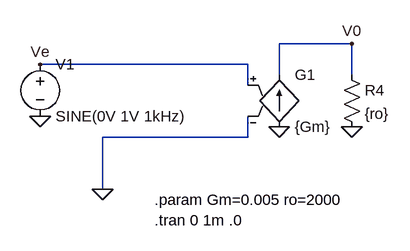
[diagram p0: schematic tut1ques3a.asc]
tut1ques3a.asc, the LTspice schematic file:
Version 4
SHEET 1 880 680
WIRE 96 -128 -16 -128
WIRE -64 -96 -384 -96
WIRE -16 -80 -16 -128
WIRE 96 -80 96 -128
WIRE -64 -64 -64 -96
WIRE -64 16 -64 -16
WIRE -64 16 -288 16
WIRE -288 96 -288 16
FLAG -16 0 0
FLAG 96 0 0
FLAG -384 -16 0
FLAG -288 96 0
FLAG -384 -96 Ve
FLAG 96 -128 V0
SYMBOL res 80 -96 R0
SYMATTR InstName R4
SYMATTR Value {ro}
SYMBOL voltage -384 -112 R0
SYMATTR InstName V1
SYMATTR Value SINE(0V 1V 1kHz)
SYMBOL g -16 -96 R0
SYMATTR InstName G1
SYMATTR Value {Gm}
TEXT -208 112 Left 2 !.param Gm=0.005 ro=2000
TEXT -208 144 Left 2 !.tran 0 1m .0

The netlist it stands for:
* tut1ques3a.asc
R4 V0 0 {ro}
V1 Ve 0 SINE(0V 1V 1kHz)
G1 0 V0 Ve 0 {Gm}
.param Gm=0.005 ro=2000
.tran 0 1m .0
.backanno
.end